# Altium project displayLCD.PrjPcb
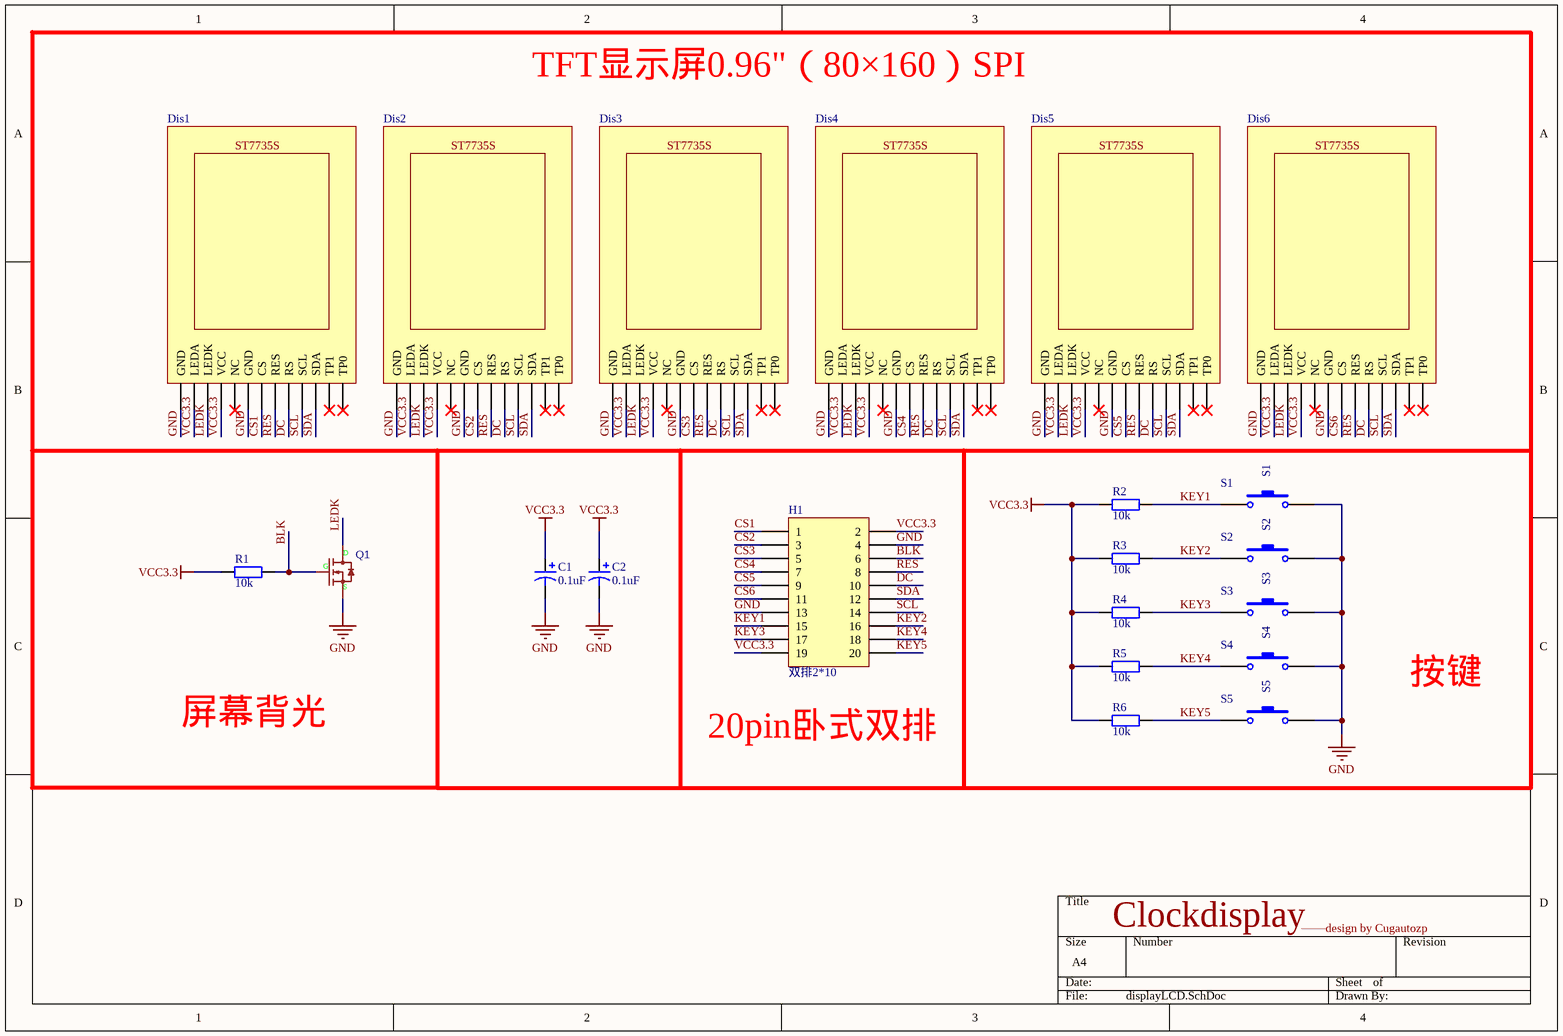
[diagram p0: displayLCD.SchDoc]
1 sheet, 21 parts. Net scope: global (net labels, ports and power ports of the same name join across sheets).
Board file: displayLCD.PcbDoc

## Sheet displayLCD.SchDoc
size A4

### Parts
C1  0.1uF  [Cap0603]
C2  0.1uF  [Cap0603]
Dis1  LCD80*160  [LCD屏80*160]  (value not drawn)
Dis2  LCD80*160  [LCD屏80*160]  (value not drawn)
Dis3  LCD80*160  [LCD屏80*160]  (value not drawn)
Dis4  LCD80*160  [LCD屏80*160]  (value not drawn)
Dis5  LCD80*160  [LCD屏80*160]  (value not drawn)
Dis6  LCD80*160  [LCD屏80*160]  (value not drawn)
H1  双排2*10  [pin20双排母]
Q1  LN4812LT1G  [sot23]  (value not drawn)
R1  10k  [R0603]
R2  10k  [R0603]
R3  10k  [R0603]
R4  10k  [R0603]
R5  10k  [R0603]
R6  10k  [R0603]
S1  S1  [key(按键)]
S2  S2  [key(按键)]
S3  S3  [key(按键)]
S4  S4  [key(按键)]
S5  S5  [key(按键)]

### Nets
GND: C1.2 C2.2 Dis1.8(GND) Dis1.13(GND) Dis2.8(GND) Dis2.13(GND) Dis3.8(GND) Dis3.13(GND) Dis4.8(GND) Dis4.13(GND) Dis5.8(GND) Dis5.13(GND) Dis6.8(GND) Dis6.13(GND) H1.4 H1.13 Q1.2(S) S1.2 S2.2 S3.2 S4.2 S5.2
VCC3.3: C1.1 C2.1 Dis1.10(VCC) Dis1.12(LEDA) Dis2.10(VCC) Dis2.12(LEDA) Dis3.10(VCC) Dis3.12(LEDA) Dis4.10(VCC) Dis4.12(LEDA) Dis5.10(VCC) Dis5.12(LEDA) Dis6.10(VCC) Dis6.12(LEDA) H1.2 H1.19 R1.1 R2.1 R3.1 R4.1 R5.1 R6.1
BLK: H1.6 Q1.1(G) R1.2
CS1: Dis1.7(CS) H1.1
CS2: Dis2.7(CS) H1.3
CS3: Dis3.7(CS) H1.5
CS4: Dis4.7(CS) H1.7
CS5: Dis5.7(CS) H1.9
CS6: Dis6.7(CS) H1.11
DC: Dis1.5(RS) Dis2.5(RS) Dis3.5(RS) Dis4.5(RS) Dis5.5(RS) Dis6.5(RS) H1.10
KEY1: H1.15 R2.2 S1.1
KEY2: H1.16 R3.2 S2.1
KEY3: H1.17 R4.2 S3.1
KEY4: H1.18 R5.2 S4.1
KEY5: H1.20 R6.2 S5.1
LEDK: Dis1.11(LEDK) Dis2.11(LEDK) Dis3.11(LEDK) Dis4.11(LEDK) Dis5.11(LEDK) Dis6.11(LEDK) Q1.3(D)
RES: Dis1.6(RES) Dis2.6(RES) Dis3.6(RES) Dis4.6(RES) Dis5.6(RES) Dis6.6(RES) H1.8
SCL: Dis1.4(SCL) Dis2.4(SCL) Dis3.4(SCL) Dis4.4(SCL) Dis5.4(SCL) Dis6.4(SCL) H1.14
SDA: Dis1.3(SDA) Dis2.3(SDA) Dis3.3(SDA) Dis4.3(SDA) Dis5.3(SDA) Dis6.3(SDA) H1.12

Not connected (* = marked no-connect by the designer): Dis1 1(TP0)* 2(TP1)* 9(NC)*; Dis2 1(TP0)* 2(TP1)* 9(NC)*; Dis3 1(TP0)* 2(TP1)* 9(NC)*; Dis4 1(TP0)* 2(TP1)* 9(NC)*; Dis5 1(TP0)* 2(TP1)* 9(NC)*; Dis6 1(TP0)* 2(TP1)* 9(NC)*

### Notes on the sheet
- TFT显示屏0.96"（80×160）SPI
- 按键
- 屏幕背光
- 20pin卧式双排
- Clockdisplay
- ——design by Cugautozp
- (in symbol LCD80*160) ST7735S

### Library data of the parts
C1 C2 = Cap Pol3: Polarized Capacitor (Surface Mount); Published: 8-Jun-2000; LatestRevisionDate: 29-May-2009; LatestRevisionNote: IPC-7351 Footprint Added.; PackageReference: C0805; Publisher: Altium Limited; PackageDescription: Chip Capacitor; Value: 0.1uF
Q1 = LN4812LT1G: BOM_Manufacturer: LRC(乐山无线电); Contributor: LCSC; BOM_Supplier: LCSC; BOM_Supplier Part: C559076; BOM_Manufacturer Part: LN4812LT1G; BOM_JLCPCB Part Class: Extended Part; spicePre: Q; spiceSymbolName: LN4812LT1G
R1-R6 = Res2: Resistor; Published: 8-Jun-2000; LatestRevisionDate: 17-Jul-2002; LatestRevisionNote: Re-released for DXP Platform.; PackageReference: AXIAL-0.4; Publisher: Altium Limited; PackageDescription: Axial Device, Thru-Hole; 2 Leads; 0.4 in Pin Spacing; Value: 10K
S1-S5 = SW-PB: Switch; Published: 24-Mar-1999; LatestRevisionDate: 17-Jul-2002; LatestRevisionNote: Re-released for DXP Platform.; PackageReference: SPST-2; Publisher: Altium Limited; PackageDescription: Switch; 2 Leads